# Altium project 遥控器.PrjPCB
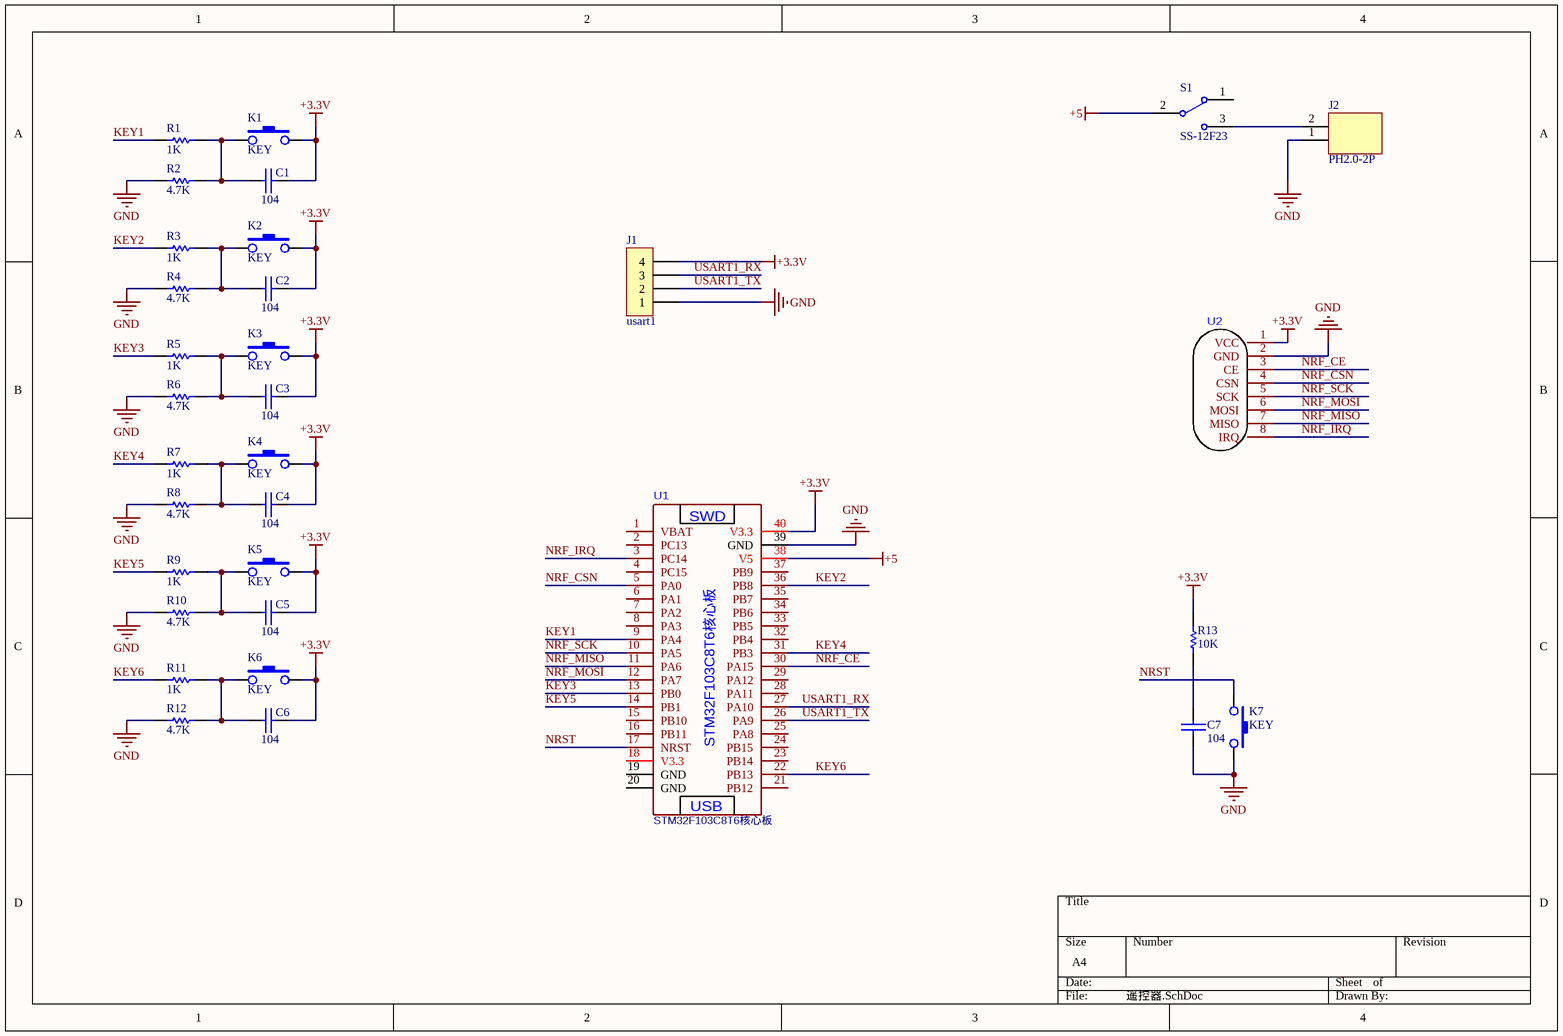
[diagram p0: 遥控器.SchDoc]
1 sheet, 32 parts. Net scope: global (net labels, ports and power ports of the same name join across sheets).
Board file: 遥控器.PcbDoc

## Sheet 遥控器.SchDoc
size A4

### Parts
C1  104  [0805C]
C2  104  [0805C]
C3  104  [0805C]
C4  104  [0805C]
C5  104  [0805C]
C6  104  [0805C]
C7  104  [0805C]
J1  usart1  [Pin HDR1X4/2.54mm-S]
J2  PH2.0-2P  [PH2.0S-2P]
K1  KEY  [DIP-6X6X5]
K2  KEY  [DIP-6X6X5]
K3  KEY  [DIP-6X6X5]
K4  KEY  [DIP-6X6X5]
K5  KEY  [DIP-6X6X5]
K6  KEY  [DIP-6X6X5]
K7  KEY  [DIP-6X6X5]
R1  1K  [0805R]
R2  4.7K  [0805R]
R3  1K  [0805R]
R4  4.7K  [0805R]
R5  1K  [0805R]
R6  4.7K  [0805R]
R7  1K  [0805R]
R8  4.7K  [0805R]
R9  1K  [0805R]
R10  4.7K  [0805R]
R11  1K  [0805R]
R12  4.7K  [0805R]
R13  10K  [0805R]
S1  SS-12F23  [SS-12F23]
U1  STM32F103C8T6核心板  [STM32F103]
U2  (no value)  [NRF24L01+ SMD]

### Nets
+3.3V: C1.2 C2.2 C3.2 C4.2 C5.2 C6.2 J1.4 K1.3 K2.3 K3.3 K4.3 K5.3 K6.3 R13.2 U1.40(V3.3) U2.1(VCC)
+5: S1.2 U1.38(V5)
GND: C7.1 J1.1 J2.1 K7.3 R2.1 R4.1 R6.1 R8.1 R10.1 R12.1 U1.39(GND) U2.2(GND)
KEY1: R1.1 U1.9(PA4)
KEY2: R3.1 U1.36(PB8)
KEY3: R5.1 U1.13(PB0)
KEY4: R7.1 U1.31(PB3)
KEY5: R9.1 U1.14(PB1)
KEY6: R11.1 U1.22(PB13)
NRF_CE: U1.30(PA15) U2.3(CE)
NRF_CSN: U1.5(PA0) U2.4(CSN)
NRF_IRQ: U1.3(PC14) U2.8(IRQ)
NRF_MISO: U1.11(PA6) U2.7(MISO)
NRF_MOSI: U1.12(PA7) U2.6(MOSI)
NRF_SCK: U1.10(PA5) U2.5(SCK)
NRST: K7.1 U1.17(NRST)
USART1_RX: J1.3 U1.27(PA10)
USART1_TX: J1.2 U1.26(PA9)
NetC1_1: C1.1 K1.1 R1.2 R2.2
NetC2_1: C2.1 K2.1 R3.2 R4.2
NetC3_1: C3.1 K3.1 R5.2 R6.2
NetC4_1: C4.1 K4.1 R7.2 R8.2
NetC5_1: C5.1 K5.1 R9.2 R10.2
NetC6_1: C6.1 K6.1 R11.2 R12.2
NetC7_2: C7.2 R13.1
NetJ2_2: J2.2 S1.3

Not connected (* = marked no-connect by the designer): S1 1; U1 1(VBAT) 2(PC13) 4(PC15) 6(PA1) 7(PA2) 8(PA3) 15(PB10) 16(PB11) 18(V3.3) 19(GND) 20(GND) 21(PB12) 23(PB14) 24(PB15) 25(PA8) 28(PA11) 29(PA12) 32(PB4) 33(PB5) 34(PB6) 35(PB7) 37(PB9)

### Notes on the sheet
- (in symbol STM32F103C8T6核心板) SWD; USB

### Library data of the parts
C1-C7 = CAP: 无极性电容
J1 = Pin HDR1X4
R1-R13 = RES
U2 = nRF24l01